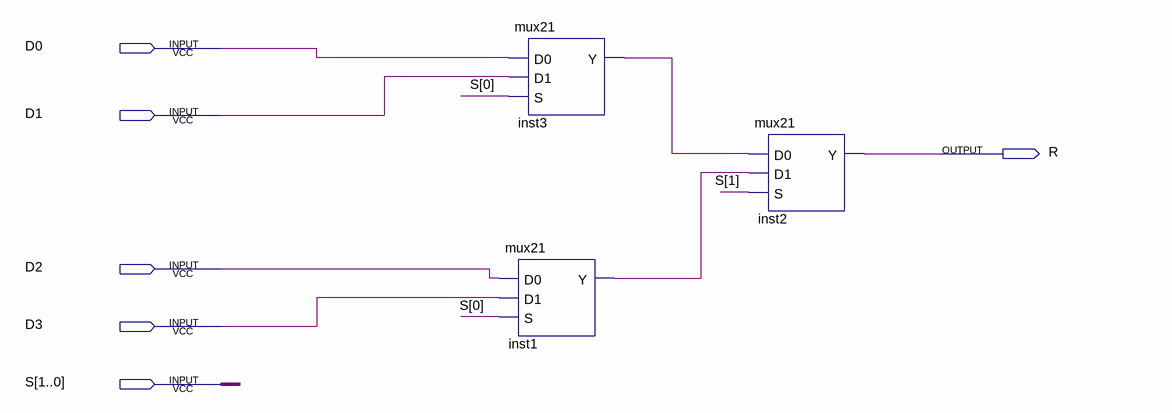
[diagram p0: schematic sheet]
// Quartus schematic mux41.bdf as structural Verilog: 3 symbols, 6 pins
module mux41 (
  input  D0,
  input  D1,
  input  D2,
  input  D3,
  input  [1:0] S,
  output R
);

  wire inst1_y, inst3_y;

  mux21 inst3 (.D0(D0), .D1(D1), .S(S[0]), .Y(inst3_y));
  mux21 inst1 (.D0(D2), .D1(D3), .S(S[0]), .Y(inst1_y));
  mux21 inst2 (.D0(inst3_y), .D1(inst1_y), .S(S[1]), .Y(R));
endmodule
